# Altium schematic sheet P18_USB 3.0 DRD.SchDoc
size 420 x 297 mm
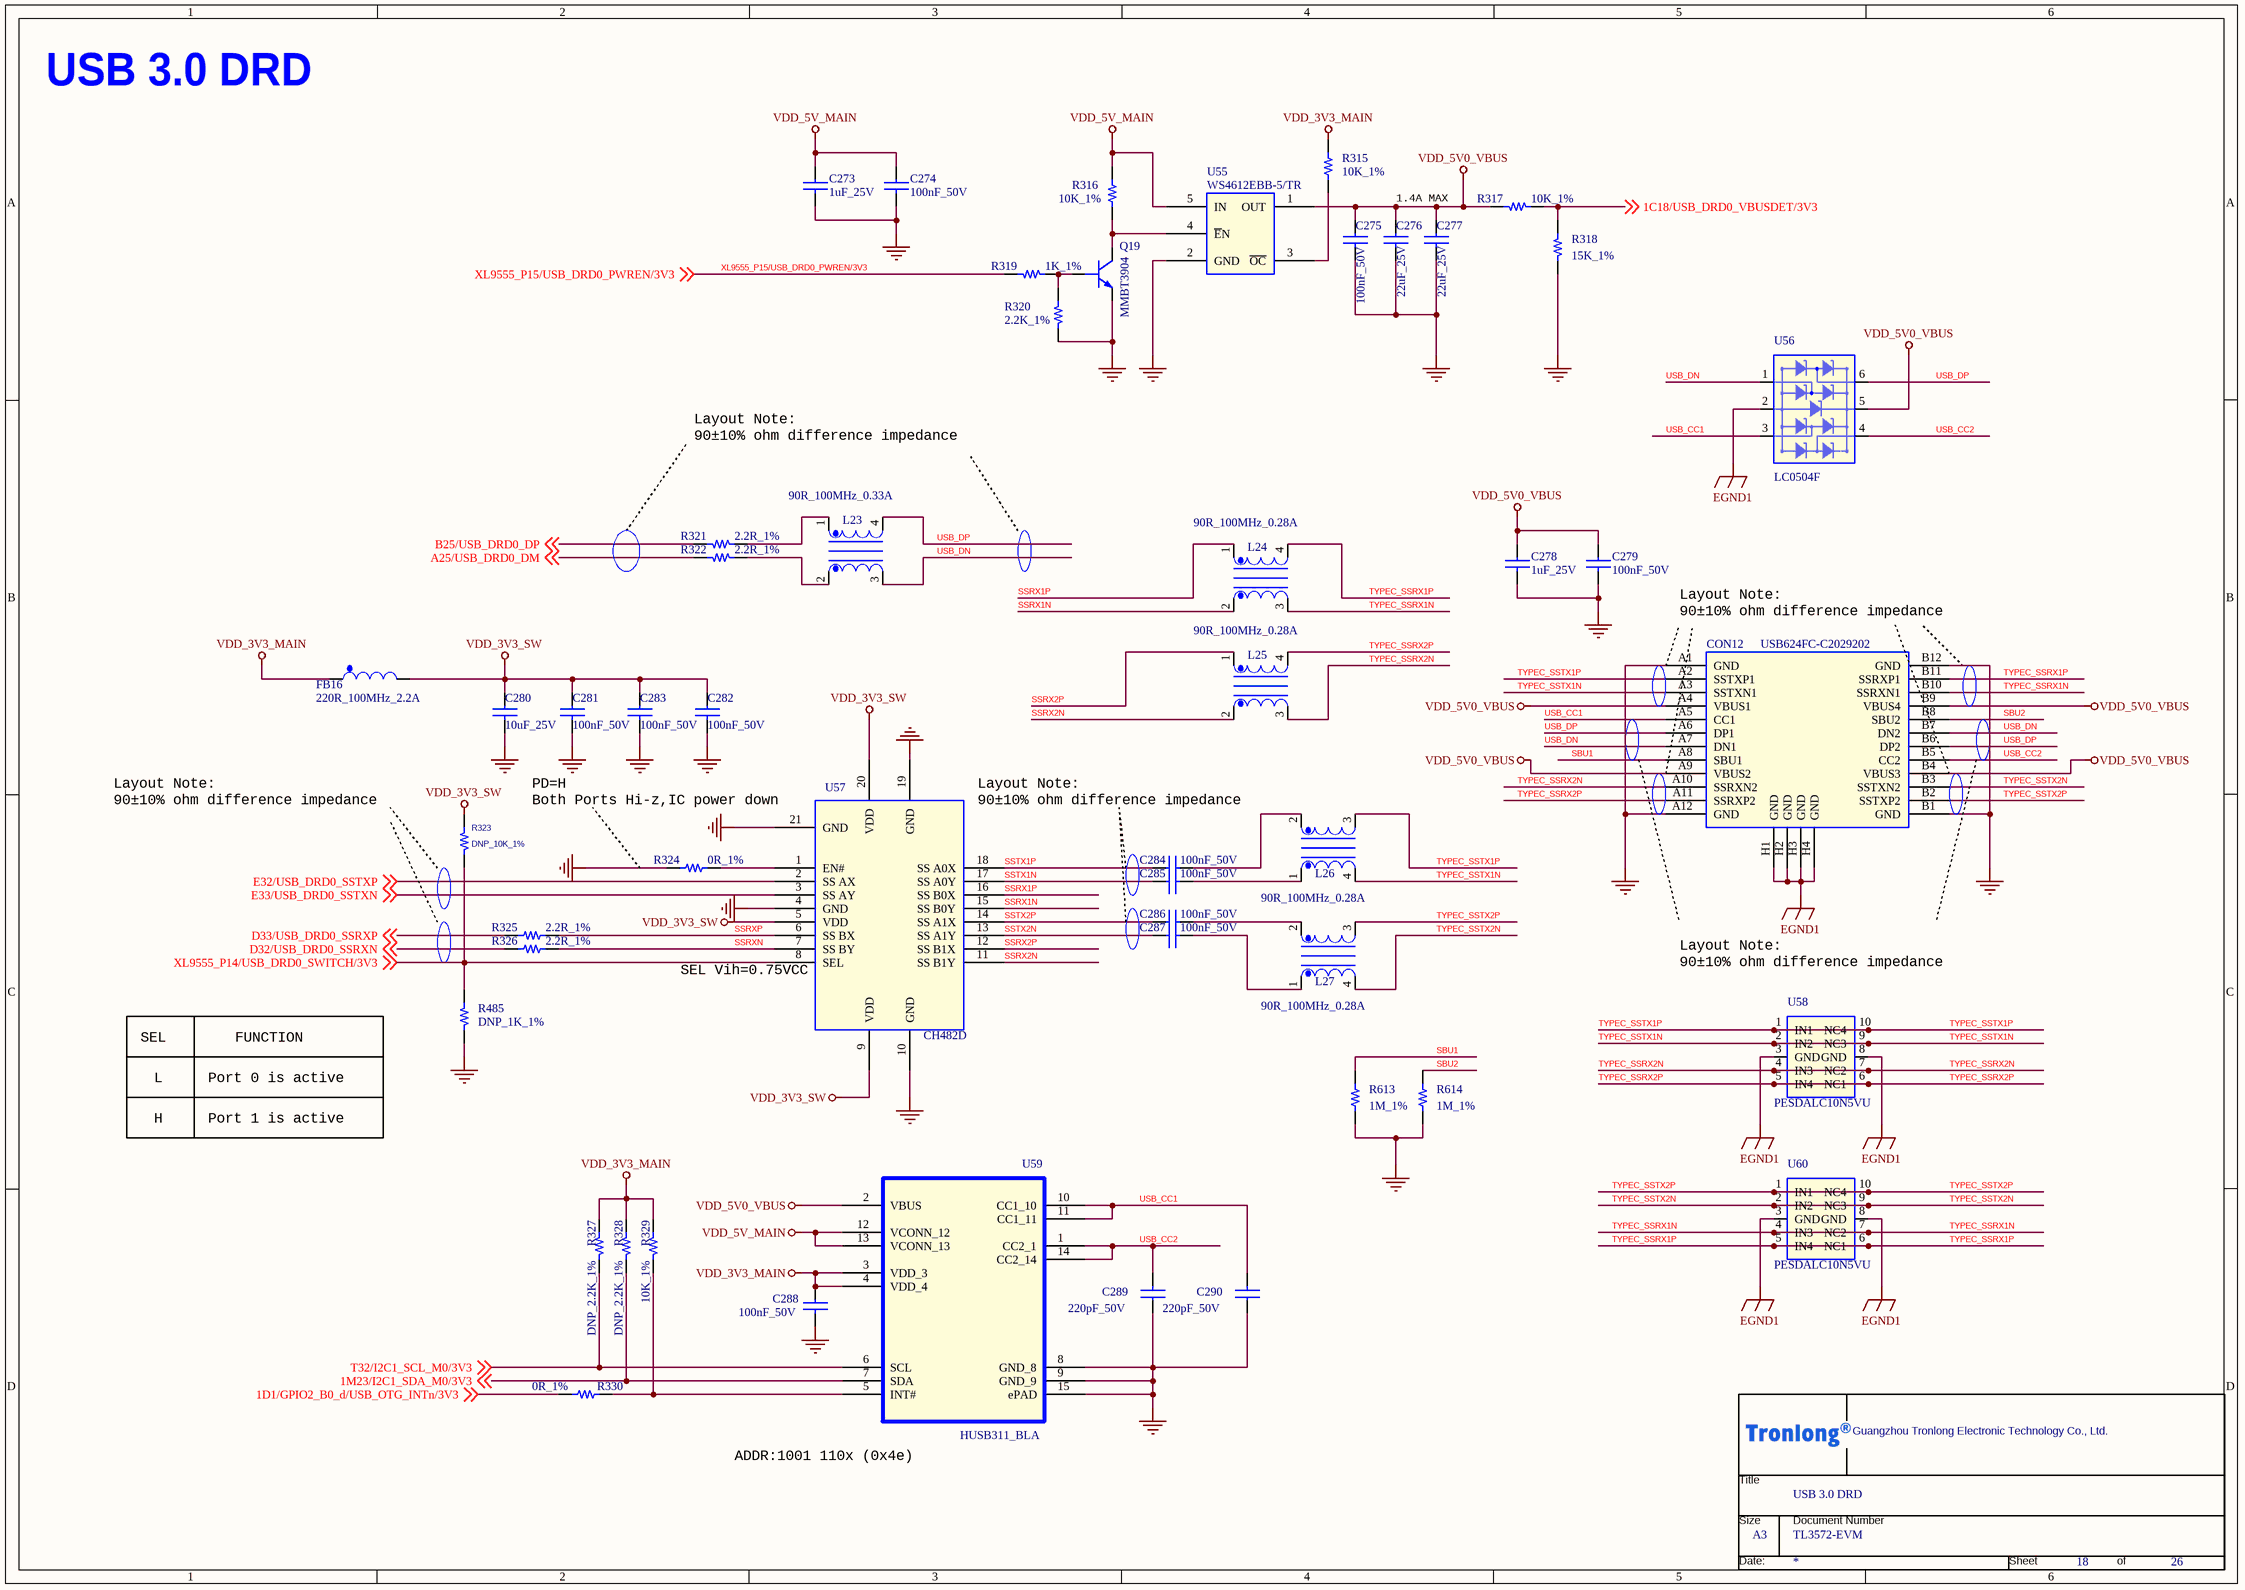
[diagram p0: P18_USB 3.0 DRD.SchDoc]

## Parts
*  Doc: TL3572-EVM  Title: USB 3.0 DRD  OrgName: Guangzhou Tronlong Electronic Technology Co., Ltd.  Page Size: A3  Page Number: 18  Page Count: 26  (hidden comment: Tronlong_TITTLE_20211115)  (graphical)
C273  1uF_25V  [C0402]
C274  100nF_50V  [C0402]
C275  100nF_50V  [C0402]
C276  22uF_25V  [C0805]
C277  22uF_25V  [C0805]
C278  1uF_25V  [C0402]
C279  100nF_50V  [C0402]
C280  10uF_25V  [C0603]
C281  100nF_50V  [C0402]
C282  100nF_50V  [C0402]
C283  100nF_50V  [C0402]
C284  100nF_50V  [C0402]
C285  100nF_50V  [C0402]
C286  100nF_50V  [C0402]
C287  100nF_50V  [C0402]
C288  100nF_50V  [C0402]
C289  220pF_50V  [C0402]
C290  220pF_50V  [C0402]
CON12  USB624FC-C2029202  [TYPE-C_24P_180_SMD]
FB16  220R_100MHz_2.2A  [L0603]
L23  90R_100MHz_0.33A  [SMD-L2012M-4P]
L24  90R_100MHz_0.28A  [SMD-L2012M-4P]
L25  90R_100MHz_0.28A  [SMD-L2012M-4P]
L26  90R_100MHz_0.28A  [SMD-L2012M-4P]
L27  90R_100MHz_0.28A  [SMD-L2012M-4P]
Q19  MMBT3904  [SOT23-3_DBZ3]
R315  10K_1%  [R0402]
R316  10K_1%  [R0402]
R317  10K_1%  [R0402]
R318  15K_1%  [R0402]
R319  1K_1%  [R0603]
R320  2.2K_1%  [R0603]
R321  2.2R_1%  [R0402]
R322  2.2R_1%  [R0402]
R323  DNP_10K_1%  [R0402]
R324  0R_1%  [R0402]
R325  2.2R_1%  [R0402]
R326  2.2R_1%  [R0402]
R327  DNP_2.2K_1%  [R0402]
R328  DNP_2.2K_1%  [R0402]
R329  10K_1%  [R0402]
R330  0R_1%  [R0402]
R485  DNP_1K_1%  [R0603]
R613  1M_1%  [R0402]
R614  1M_1%  [R0402]
U55  WS4612EBB-5/TR  [SOT23-5]
U56  LC0504F  [SOT363]
U57  CH482D  [qfn2545-20-ch482d]
U58  PESDALC10N5VU  [DFN-10-2510]
U59  HUSB311_BLA  [MLP14_2R50X2R50X0R80]
U60  PESDALC10N5VU  [DFN-10-2510]

## Nets
EGND1: CON12.H1(GND) CON12.H2(GND) CON12.H3(GND) CON12.H4(GND) U56.2 U58.3(GND) U58.8(GND) U60.3(GND) U60.8(GND)
GND: C273.2 C274.2 C275.2 C276.2 C277.2 C278.2 C279.2 C280.2 C281.2 C282.2 C283.2 C288.2 C289.1 C290.1 CON12.A1(GND) CON12.A12(GND) CON12.B1(GND) CON12.B12(GND) Q19.2(E) R318.2 R320.2 R324.1 R485.2 R613.2 R614.2 U55.2(GND) U57.4(GND) U57.10(GND) U57.19(GND) U57.21(GND) U59.8(GND_8) U59.9(GND_9) U59.15(ePAD)
VDD_3V3_MAIN: C288.1 FB16.1 R315.2 R327.1 R328.1 R329.1 U59.3(VDD_3) U59.4(VDD_4)
VDD_3V3_SW: C280.1 C281.1 C282.1 C283.1 FB16.2 R323.2 U57.5(VDD) U57.9(VDD) U57.20(VDD)
VDD_5V0_VBUS: C275.1 C276.1 C277.1 C278.1 C279.1 CON12.A4(VBUS1) CON12.A9(VBUS2) CON12.B4(VBUS3) CON12.B9(VBUS4) R317.2 U55.1(OUT) U56.5 U59.2(VBUS)
VDD_5V_MAIN: C273.1 C274.1 R316.1 U55.5(IN) U59.12(VCONN_12) U59.13(VCONN_13)
1C18/USB_DRD0_VBUSDET/3V3: R317.1 R318.1 ; off-sheet 1C18/USB_DRD0_VBUSDET/3V3
1D1/GPIO2_B0_d/USB_OTG_INTn/3V3: R330.1 ; off-sheet 1D1/GPIO2_B0_d/USB_OTG_INTn/3V3
1M23/I2C1_SDA_M0/3V3: R328.2 U59.7(SDA) ; off-sheet 1M23/I2C1_SDA_M0/3V3
A25/USB_DRD0_DM: R322.1 ; off-sheet A25/USB_DRD0_DM
B25/USB_DRD0_DP: R321.1 ; off-sheet B25/USB_DRD0_DP
D32/USB_DRD0_SSRXN: R326.1 ; off-sheet D32/USB_DRD0_SSRXN
D33/USB_DRD0_SSRXP: R325.1 ; off-sheet D33/USB_DRD0_SSRXP
E32/USB_DRD0_SSTXP: U57.2(SS_AX) ; off-sheet E32/USB_DRD0_SSTXP
E33/USB_DRD0_SSTXN: U57.3(SS_AY) ; off-sheet E33/USB_DRD0_SSTXN
SBU1: CON12.A8(SBU1) R613.1
SBU2: CON12.B8(SBU2) R614.1
SSRX1N: L24.2 U57.15(SS_B0Y)
SSRX1P: L24.1 U57.16(SS_B0X)
SSRX2N: L25.2 U57.11(SS_B1Y)
SSRX2P: L25.1 U57.12(SS_B1X)
SSRXN: R326.2 U57.7(SS_BY)
SSRXP: R325.2 U57.6(SS_BX)
SSTX1N: C285.1 U57.17(SS_A0Y)
SSTX1P: C284.1 U57.18(SS_A0X)
SSTX2N: C287.1 U57.13(SS_A1Y)
SSTX2P: C286.1 U57.14(SS_A1X)
T32/I2C1_SCL_M0/3V3: R327.2 U59.6(SCL) ; off-sheet T32/I2C1_SCL_M0/3V3
TYPEC_SSRX1N: CON12.B10(SSRXN1) L24.3 U60.4(IN3) U60.7(NC2)
TYPEC_SSRX1P: CON12.B11(SSRXP1) L24.4 U60.5(IN4) U60.6(NC1)
TYPEC_SSRX2N: CON12.A10(SSRXN2) L25.3 U58.4(IN3) U58.7(NC2)
TYPEC_SSRX2P: CON12.A11(SSRXP2) L25.4 U58.5(IN4) U58.6(NC1)
TYPEC_SSTX1N: CON12.A3(SSTXN1) L26.4 U58.2(IN2) U58.9(NC3)
TYPEC_SSTX1P: CON12.A2(SSTXP1) L26.3 U58.1(IN1) U58.10(NC4)
TYPEC_SSTX2N: CON12.B3(SSTXN2) L27.4 U60.2(IN2) U60.9(NC3)
TYPEC_SSTX2P: CON12.B2(SSTXP2) L27.3 U60.1(IN1) U60.10(NC4)
USB_CC1: C290.2 CON12.A5(CC1) U56.3 U59.10(CC1_10) U59.11(CC1_11)
USB_CC2: C289.2 CON12.B5(CC2) U56.4 U59.1(CC2_1) U59.14(CC2_14)
USB_DN: CON12.A7(DN1) CON12.B7(DN2) L23.3 U56.1
USB_DP: CON12.A6(DP1) CON12.B6(DP2) L23.4 U56.6
XL9555_P14/USB_DRD0_SWITCH/3V3: R323.1 R485.1 U57.8(SEL) ; off-sheet XL9555_P14/USB_DRD0_SWITCH/3V3
XL9555_P15/USB_DRD0_PWREN/3V3: R319.1 ; off-sheet XL9555_P15/USB_DRD0_PWREN/3V3
NetC284_2: C284.2 L26.2
NetC285_2: C285.2 L26.1
NetC286_2: C286.2 L27.2
NetC287_2: C287.2 L27.1
NetL23_1: L23.1 R321.2
NetL23_2: L23.2 R322.2
NetQ19_1: Q19.1(B) R319.2 R320.1
NetQ19_3: Q19.3(C) R316.2 U55.4(~{E}N)
NetR315_1: R315.1 U55.3(~{OC})
NetR324_2: R324.2 U57.1(EN#)
NetR329_2: R329.2 R330.2 U59.5(INT#)

## Notes on the sheet
- USB 3.0 DRD
- 1.4A MAX
- Layout Note:
  90±10% ohm difference impedance
- (near CON12) Layout Note:
  90±10% ohm difference impedance
- (near R323) Layout Note:
  90±10% ohm difference impedance
- (near U57) PD=H
  Both Ports Hi-z,IC power down
- (near U57) Layout Note:
  90±10% ohm difference impedance
- (near U57) SEL Vih=0.75VCC
- SEL
- FUNCTION
- L
- H
- Port 0 is active
- Port 1 is active
- ADDR:1001 110x (0x4e)
- (in symbol Tronlong_TITTLE_20211115) Title; Size; Document Number; Date:; Sheet; of

## Library data of the parts
* = Tronlong_TITTLE_20211115: RevCode: A?; Page Create Date: March  8, 1995; Page Modify Date: *
C273 = CAP NP_Dup3: 贴片陶瓷电容,1uF,10%,25V,X5R; Manufacturer Character: 中国大陆; Manufacturer: 广东风华高新科技股份有限公司（FH）; Manufacturer PartNumber: 0402X105K250NT; As-Welded: /; room: USB HUB; Operation Temperature（℃）: -55~+85(Ta); ERP Number: 005.0001.0001.00640; Eco-Label: ROHS; PCB Footprint: C0402; Part Status: 试用; Temperature: -55~155℃
C274 C279 = CAP NP_Dup3: 贴片陶瓷电容,100nF,10%,50V,X7R; Manufacturer Character: 中国大陆; Manufacturer: 广东风华高新科技股份有限公司（FH）; Manufacturer PartNumber: 0402B104K500NT; As-Welded: /; room: USB HUB; Operation Temperature（℃）: -55~+125(Ta); ERP Number: 005.0001.0001.00681; Eco-Label: ROHS; PCB Footprint: C0402; Temperature: -55~155℃; Part Status: 试用
C275 = CAP NP_Dup3: 贴片陶瓷电容,100nF,10%,50V,X7R; Manufacturer Character: 中国大陆; Manufacturer PartNumber: 0402B104K500NT; Manufacturer: 广东风华高新科技股份有限公司（FH）; As-Welded: /; room: DRDUSB; Operation Temperature（℃）: -55~+125(Ta); ERP Number: 005.0001.0001.00681; Eco-Label: ROHS; PCB Footprint: C0402; Temperature: -55~155℃; Part Status: 试用
C276 = CAP NP_Dup3: 贴片陶瓷电容,22uF,20%,25V,X5R; Manufacturer Character: 中国大陆; Manufacturer: 广东风华高新科技股份有限公司（FH）; Manufacturer PartNumber: 0805X226M250NT; As-Welded: /; room: DRDUSB; Operation Temperature（℃）: -55~+85(Ta); ERP Number: 005.0001.0001.00524; Eco-Label: ROHS; PCB Footprint: C0805; Part Status: 优选; Temperature: -55~155℃
C277 = CAP NP_Dup3: 贴片陶瓷电容,22uF,20%,25V,X5R; Manufacturer Character: 中国大陆; Manufacturer PartNumber: 0805X226M250NT; Manufacturer: 广东风华高新科技股份有限公司（FH）; Eco-Label: ROHS; ERP Number: 005.0001.0001.00524; As-Welded: /; room: DRDUSB; Operation Temperature（℃）: -55~+85(Ta); PCB Footprint: C0805; Part Status: 优选; Temperature: -55~155℃
C278 = CAP NP_Dup3: 贴片陶瓷电容,1uF,10%,25V,X5R; Manufacturer PartNumber: 0402X105K250NT; Manufacturer: 广东风华高新科技股份有限公司（FH）; Manufacturer Character: 中国大陆; Eco-Label: ROHS; ERP Number: 005.0001.0001.00640; Operation Temperature（℃）: -55~+85(Ta); room: USB HUB; As-Welded: /; PCB Footprint: C0402; Part Status: 试用; Temperature: -55~155℃
C280 = CAP NP_Dup2: 贴片陶瓷电容,10uF,20%,25V,X5R; Manufacturer Character: 中国大陆; Manufacturer: 广东风华高新科技股份有限公司（FH）; Manufacturer PartNumber: 0603X106M250NT; Eco-Label: ROHS; ERP Number: 005.0001.0001.00527; RK PN: C1608X5R1A106K080AC; Priority: A; C_Voltage: 6.3V; Tolerance: 10%; Voltage: 10V; Operation Temperature（℃）: -55~+85(Ta); As-Welded: /; PCB Footprint: C0603; Part Status: 优选; ERP PCB Footprint: C0603; Part Type: C0603; Dielectric: X5R; Manufacturer PN: C1608X5R1A106K080AC; Created by: JJJ
C281 C286 = CAP NP_Dup2: 贴片陶瓷电容,100nF,10%,50V,X7R; Manufacturer: 广东风华高新科技股份有限公司（FH）; Manufacturer PartNumber: 0402B104K500NT; Manufacturer Character: 中国大陆; Eco-Label: ROHS; ERP Number: 005.0001.0001.00681; room: USB HUB; Operation Temperature（℃）: -55~+125(Ta); As-Welded: /; PCB Footprint: C0402; ERP PCB Footprint: C0402; Temperature: -55~155℃; Part Status: 试用
C282 = CAP NP_Dup2: 贴片陶瓷电容,100nF,10%,50V,X7R; Manufacturer Character: 中国大陆; Manufacturer PartNumber: 0402B104K500NT; Manufacturer: 广东风华高新科技股份有限公司（FH）; As-Welded: /; Operation Temperature（℃）: -55~+125(Ta); room: USB HUB; ERP Number: 005.0001.0001.00681; Eco-Label: ROHS; PCB Footprint: C0402; ERP PCB Footprint: C0402; Temperature: -55~155℃; Part Status: 试用
C283 = CAP NP_Dup2: 贴片陶瓷电容,100nF,10%,50V,X7R; Manufacturer: 广东风华高新科技股份有限公司（FH）; Manufacturer PartNumber: 0402B104K500NT; Manufacturer Character: 中国大陆; Eco-Label: ROHS; ERP Number: 005.0001.0001.00681; Operation Temperature（℃）: -55~+125(Ta); room: USB HUB; As-Welded: /; PCB Footprint: C0402; ERP PCB Footprint: C0402; Temperature: -55~155℃; Part Status: 试用
C284 C287 = CAP NP_Dup2: 贴片陶瓷电容,100nF,10%,50V,X7R; Manufacturer Character: 中国大陆; Manufacturer PartNumber: 0402B104K500NT; Manufacturer: 广东风华高新科技股份有限公司（FH）; As-Welded: /; room: USB HUB; Operation Temperature（℃）: -55~+125(Ta); ERP Number: 005.0001.0001.00681; Eco-Label: ROHS; PCB Footprint: C0402; Part Status: 试用; Temperature: -55~155℃; ERP PCB Footprint: C0402
C285 = CAP NP_Dup2: 贴片陶瓷电容,100nF,10%,50V,X7R; Manufacturer: 广东风华高新科技股份有限公司（FH）; Manufacturer PartNumber: 0402B104K500NT; Manufacturer Character: 中国大陆; As-Welded: /; room: USB HUB; Operation Temperature（℃）: -55~+125(Ta); ERP Number: 005.0001.0001.00681; Eco-Label: ROHS; PCB Footprint: C0402; Part Status: 试用; Temperature: -55~155℃; ERP PCB Footprint: C0402
C288 = CAP NP_Dup3: 贴片陶瓷电容,100nF,10%,50V,X7R; Manufacturer PartNumber: 0402B104K500NT; Manufacturer: 广东风华高新科技股份有限公司（FH）; Manufacturer Character: 中国大陆; Eco-Label: ROHS; ERP Number: 005.0001.0001.00681; Operation Temperature（℃）: -55~+125(Ta); room: USB HUB; As-Welded: /; PCB Footprint: C0402; Temperature: -55~155℃; Part Status: 试用
C289 = CAP NP_Dup3: 贴片陶瓷电容,220pF,10%,50V,X7R; Manufacturer: 广东风华高新科技股份有限公司（FH）; Manufacturer Character: 中国大陆; Manufacturer PartNumber: 0402B221K500NT; As-Welded: /; Operation Temperature（℃）: -55~+125(Ta); ERP Number: 005.0001.0001.00662; Eco-Label: ROHS; PCB Footprint: C0402; Part Status: 试用
C290 = CAP NP_Dup3: 贴片陶瓷电容,220pF,10%,50V,X7R; Manufacturer PartNumber: 0402B221K500NT; Manufacturer Character: 中国大陆; Manufacturer: 广东风华高新科技股份有限公司（FH）; Eco-Label: ROHS; ERP Number: 005.0001.0001.00662; Operation Temperature（℃）: -55~+125(Ta); As-Welded: /; PCB Footprint: C0402; Part Status: 试用
CON12 = usb 3_1.0 type-c female: USB TYPE C 24P FEMALE SMT 侧贴 带定位柱 双壳点焊带弹弯脚 L=14.30 CH=5.06; Manufacturer Character: 中国大陆; Manufacturer: 深圳市爱特姆科技有限公司（ATOM）; Eco-Label: ROHS; ERP Number: 005.0001.0003.00750; As-Welded: /; Operation Temperature（℃）: -40~85(Ta); room: 10; PCB Footprint: TYPE-C_24P_180_SMD; Temperature: -40~85℃; Manufacturer PartNumber: USB624FC-C2029202; Part Status: 试用
FB16 = FERRITE BEAD: 磁珠,50mΩ,2.2A,220R@100MHz; Manufacturer PartNumber: UPZ1608U221-2R2TF; Manufacturer: 深圳顺络电子股份有限公司（Sunlord）; Manufacturer Character: 中国大陆; ERP PCB Footprint: L0603I; As-Welded: /; room: USB HUB; Operation Temperature（℃）: -55~+125(Ta); ERP Number: 005.0001.0007.00015; Eco-Label: ROHS; PCB Footprint: L0603; Part Status: 限选; Temperature: -55~+125(Ta)
L23 = TFR_AXA_A_1: 贴片共模电感,350mΩ,0.33A,50V,90Ω@100MHz; Manufacturer Character: 中国大陆; Manufacturer: 深圳顺络电子股份有限公司（Sunlord）; Manufacturer PartNumber: SDCW2012-2-900TF; ERP Number: 005.0001.0006.00172; Operation Temperature（℃）: -40~+85(Ta); As-Welded: /; Eco-Label: ROHS; PCB Footprint: SMD-L2012M-4P; Part Status: 测评
L24 L25 = TFR_AXA_A_1: 贴片共模电感,400mΩ,0.28A,20V,90Ω@100MHz; Manufacturer PartNumber: SDCW2012U-2-900TF; Manufacturer: 深圳顺络电子股份有限公司（Sunlord）; Manufacturer Character: 中国大陆; Eco-Label: ROHS; ERP Number: 005.0001.0006.00186; Operation Temperature（℃）: -40~+85(Ta); As-Welded: /; PCB Footprint: SMD-L2012M-4P; Part Status: 试用
L26 L27 = TFR_AXA_A_1: 贴片共模电感,400mΩ,0.28A,20V,90Ω@100MHz; Manufacturer Character: 中国大陆; Manufacturer: 深圳顺络电子股份有限公司（Sunlord）; Manufacturer PartNumber: SDCW2012U-2-900TF; Eco-Label: ROHS; As-Welded: /; Operation Temperature（℃）: -40~+85(Ta); ERP Number: 005.0001.0006.00186; PCB Footprint: SMD-L2012M-4P; Part Status: 试用
Q19 = MMBT3904/SOT: BJT,NPN,Vceo=40V,Ic=200mA,fT=300MHz,PD=200mW; Manufacturer: 江苏长晶科技股份有限公司（JSCJ）; Manufacturer Character: 中国大陆; As-Welded: /; Operation Temperature（℃）: -55~+150(Tj); ERP Number: 005.0001.0008.00002; Eco-Label: ROHS; PCB Footprint: SOT23-3_DBZ3; Temperature: -55~150℃; Manufacturer PartNumber: MMBT3904; Part Status: 优选
R315 = Resistor_Dup4: 贴片电阻,10K,±1%,1/16W; Manufacturer: 广东风华高新科技股份有限公司（FH）; Manufacturer PartNumber: RC-02K1002FT; Manufacturer Character: 中国大陆; CLASS: DISCRETE; Eco-Label: ROHS; ERP Number: 005.0001.0002.01326; Operation Temperature（℃）: -55~+125(Ta); room: DRDUSB; As-Welded: /; PCB Footprint: R0402; Temperature: -55~155℃; Part Status: 优选
R316 = Resistor_Dup4: 贴片电阻,10K,±1%,1/16W; Manufacturer PartNumber: RC-02K1002FT; Manufacturer: 广东风华高新科技股份有限公司（FH）; Manufacturer Character: 中国大陆; CLASS: DISCRETE; As-Welded: /; ERP Number: 005.0001.0002.01326; Operation Temperature（℃）: -55~+125(Ta); room: USB3.0; Eco-Label: ROHS; PCB Footprint: R0402; Temperature: -55~155℃; Part Status: 优选
R317 = Resistor_Dup3: 贴片电阻,10K,±1%,1/16W; Manufacturer Character: 中国大陆; Manufacturer: 广东风华高新科技股份有限公司（FH）; Manufacturer PartNumber: RC-02K1002FT; CLASS: DISCRETE; Eco-Label: ROHS; ERP Number: 005.0001.0002.01326; Operation Temperature（℃）: -55~+125(Ta); room: USB HUB; As-Welded: /; PCB Footprint: R0402; Part Status: 优选; Temperature: -55~155℃; ERP PCB Footprint: R0402
R318 = Resistor_Dup3: 贴片电阻,15K,±1%,1/16W; Manufacturer PartNumber: RC-02K1502FT; Manufacturer: 广东风华高新科技股份有限公司（FH）; Manufacturer Character: 中国大陆; CLASS: DISCRETE; As-Welded: /; Operation Temperature（℃）: -55~+155(Ta); room: USB HUB; ERP Number: 005.0001.0002.01309; Eco-Label: ROHS; PCB Footprint: R0402; Part Status: 试用; Temperature: -55~155℃; ERP PCB Footprint: R0402
R319 = Resistor_Dup4: 贴片电阻,1K,±1%,1/10W; Manufacturer Character: 中国大陆; Manufacturer PartNumber: RS-03K1001FT; Manufacturer: 广东风华高新科技股份有限公司（FH）; CLASS: DISCRETE; Eco-Label: ROHS; ERP Number: 005.0001.0002.00961; As-Welded: /; Operation Temperature（℃）: -55~+155(Ta); PCB Footprint: R0603; Part Status: 优选; Temperature: -55~155℃
R320 = Resistor_Dup4: 贴片电阻,2.2K,±1%,1/10W; Manufacturer Character: 中国大陆; Manufacturer PartNumber: RS-03K2201FT; Manufacturer: 广东风华高新科技股份有限公司（FH）; CLASS: DISCRETE; Eco-Label: ROHS; ERP Number: 005.0001.0002.00972; As-Welded: /; Operation Temperature（℃）: -55~+155(Ta); PCB Footprint: R0603; Part Status: 优选; Temperature: -55~155℃
R321 R322 = Resistor_Dup4: 贴片电阻,2.2R,±1%,1/16W; Manufacturer: 广东风华高新科技股份有限公司（FH）; Manufacturer PartNumber: RC-02U2R20FT; Manufacturer Character: 中国大陆; CLASS: DISCRETE; Eco-Label: ROHS; ERP Number: 005.0001.0002.00965; As-Welded: /; Operation Temperature（℃）: -55~+155(Ta); PCB Footprint: R0402; Part Status: 优选; Temperature: -55~155℃
R323 = Resistor_Dup3: 贴片电阻,10K,±1%,1/16W; Manufacturer Character: 中国大陆; Manufacturer: 广东风华高新科技股份有限公司（FH）; Manufacturer PartNumber: RC-02K1002FT; CLASS: DISCRETE; Eco-Label: ROHS; Operation Temperature（℃）: -55~+125(Ta); As-Welded: DNP; ERP Number: 005.0001.0002.01326; PCB Footprint: R0402; ERP PCB Footprint: R0402; Part Status: 优选
R324 = Resistor_Dup3: 贴片电阻,0R,±1%,1/16W; Manufacturer PartNumber: RC-02000FT; Manufacturer: 广东风华高新科技股份有限公司（FH）; Manufacturer Character: 中国大陆; CLASS: DISCRETE; Eco-Label: ROHS; ERP Number: 005.0001.0002.00938; Operation Temperature（℃）: -55~+155(Ta); As-Welded: /; PCB Footprint: R0402; ERP PCB Footprint: R0402; Part Status: 优选
R325 R326 = Resistor_Dup3: 贴片电阻,2.2R,±1%,1/16W; Manufacturer Character: 中国大陆; Manufacturer: 广东风华高新科技股份有限公司（FH）; Manufacturer PartNumber: RC-02U2R20FT; CLASS: DISCRETE; As-Welded: /; Operation Temperature（℃）: -55~+155(Ta); ERP Number: 005.0001.0002.00965; Eco-Label: ROHS; PCB Footprint: R0402; ERP PCB Footprint: R0402; Part Status: 优选
R327 = Resistor_Dup4: 贴片电阻,2.2K,±1%,1/16W; Manufacturer: 广东风华高新科技股份有限公司（FH）; Manufacturer PartNumber: RC-02K2201FT; Manufacturer Character: 中国大陆; CLASS: DISCRETE; Operation Temperature（℃）: -55~+125(Ta); As-Welded: DNP; ERP Number: 005.0001.0002.01317; Eco-Label: ROHS; PCB Footprint: R0402; Temperature: -55~155℃; Part Status: 试用
R328 = Resistor_Dup4: 贴片电阻,2.2K,±1%,1/16W; Manufacturer Character: 中国大陆; Manufacturer PartNumber: RC-02K2201FT; Manufacturer: 广东风华高新科技股份有限公司（FH）; CLASS: DISCRETE; Eco-Label: ROHS; ERP Number: 005.0001.0002.01317; As-Welded: DNP; Operation Temperature（℃）: -55~+125(Ta); PCB Footprint: R0402; Part Status: 试用; Temperature: -55~155℃
R329 = Resistor_Dup4: 贴片电阻,10K,±1%,1/16W; Manufacturer Character: 中国大陆; Manufacturer PartNumber: RC-02K1002FT; Manufacturer: 广东风华高新科技股份有限公司（FH）; CLASS: DISCRETE; room: DRDUSB; Operation Temperature（℃）: -55~+125(Ta); As-Welded: /; ERP Number: 005.0001.0002.01326; Eco-Label: ROHS; PCB Footprint: R0402; Temperature: -55~155℃; Part Status: 优选
R330 = Resistor_Dup3: 贴片电阻,0R,±1%,1/16W; Manufacturer Character: 中国大陆; Manufacturer PartNumber: RC-02000FT; Manufacturer: 广东风华高新科技股份有限公司（FH）; CLASS: DISCRETE; As-Welded: /; Operation Temperature（℃）: -55~+155(Ta); ERP Number: 005.0001.0002.00938; Eco-Label: ROHS; PCB Footprint: R0402; Part Status: 优选
R485 = Resistor_Dup4: 贴片电阻,2.2K,±1%,1/10W; Manufacturer Character: 中国大陆; Manufacturer PartNumber: RS-03K2201FT; Manufacturer: 广东风华高新科技股份有限公司（FH）; CLASS: DISCRETE; Eco-Label: ROHS; ERP Number: 005.0001.0002.00972; As-Welded: DNP; Operation Temperature（℃）: -55~+155(Ta); PCB Footprint: R0603; Part Status: 优选; Temperature: -55~155℃
R613 R614 = Resistor_Dup3: RC0402FR-071ML,0402WGF1004TCE; Manufacturer: 广州创龙; Manufacturer PartNumber: 1M,±1%,R0402,≥1/16W; CLASS: DISCRETE; Eco-Label: ROHS; ERP Number: 005.0001.0023.00078; room: USB HUB; Operation Temperature（℃）: -40~+85(Ta); As-Welded: /; PCB Footprint: R0402; Manufacturer Character: -; Part Status: -
U55 = TPS2041BDGN_0: 限流配电开关,2.5V~5.5V,1.4A; Manufacturer Character: 中国大陆; Manufacturer: 上海韦尔半导体股份有限公司（WILLSEMI）; Operation Temperature（℃）: -40~+85(Ta); room: DRDUSB; As-Welded: /; ERP Number: 005.0001.0004.00705; Eco-Label: ROHS; PCB Footprint: SOT23-5; Manufacturer PartNumber: WS4612EBB-5/TR; Temperature: -40~85℃; Part Status: 试用
U56 = PRTR5V0U4Y: ESD二极管,VRWM=5V,VBR=6V,四组,单向,8KV,15KV; Manufacturer Character: 中国大陆; Manufacturer: 上海雷卯电子科技有限公司（Leiditech）; Eco-Label: ROHS; ERP Number: 005.0001.0017.00061; As-Welded: /; Operation Temperature（℃）: -55~+125(Tj); room: DRDUSB; PCB Footprint: SOT363; Manufacturer PartNumber: LC0504F; Temperature: -55~125℃; Part Status: 优选
U57 = CH482D: 两路2选1模拟开关复用器; Manufacturer: 南京沁恒微电子股份有限公司（WCH）; Manufacturer Character: 中国大陆; As-Welded: /; Operation Temperature（℃）: -40~+85(Ta); ERP Number: 005.0001.0004.00966; Eco-Label: ROHS; ERP PCB Footprint: QFN-20; PCB Footprint: qfn2545-20-ch482d; Part Status: 试用; Manufacturer PartNumber: CH482D
U58 = SU099PGTR: ESD二极管,VRWM=5V,VBR=6V,四组,单向,15KV,30KV; Manufacturer: 上海芯导电子科技股份有限公司（Prisemi）; Manufacturer Character: 中国大陆; ERP PCB Footprint: DFN-10; As-Welded: /; Operation Temperature（℃）: -55~+150(Tj); ERP Number: 005.0001.0004.00739; Eco-Label: ROHS; PCB Footprint: DFN-10-2510; Temperature: -55~150; Manufacturer PartNumber: PESDALC10N5VU; Part Status: 优选
U59 = USB_FUSB302B: USB Type-C PD 控制器; Manufacturer: 深圳慧能泰半导体科技有限公司（Hynetek）; Manufacturer Character: 中国大陆; Operation Temperature（℃）: -40~+85(Ta); Eco-Label: ROHS; ERP Number: 005.0001.0004.01089; As-Welded: /; Priority: A; PCB Footprint: MLP14_2R50X2R50X0R80; Part Status: 试用; RK PN: HUSB311_BLA; Part Type: USB; Manufacturer PN: HUSB311_BLA; Created by: JJJ; Manufacturer PartNumber: HUSB311_BLA
U60 = SU099PGTR: ESD二极管,VRWM=5V,VBR=6V,四组,单向,15KV,30KV; Manufacturer Character: 中国大陆; Manufacturer: 上海芯导电子科技股份有限公司（Prisemi）; As-Welded: /; Operation Temperature（℃）: -55~+150(Tj); ERP Number: 005.0001.0004.00739; Eco-Label: ROHS; ERP PCB Footprint: DFN-10; PCB Footprint: DFN-10-2510; Part Status: 优选; Manufacturer PartNumber: PESDALC10N5VU; Temperature: -55~150